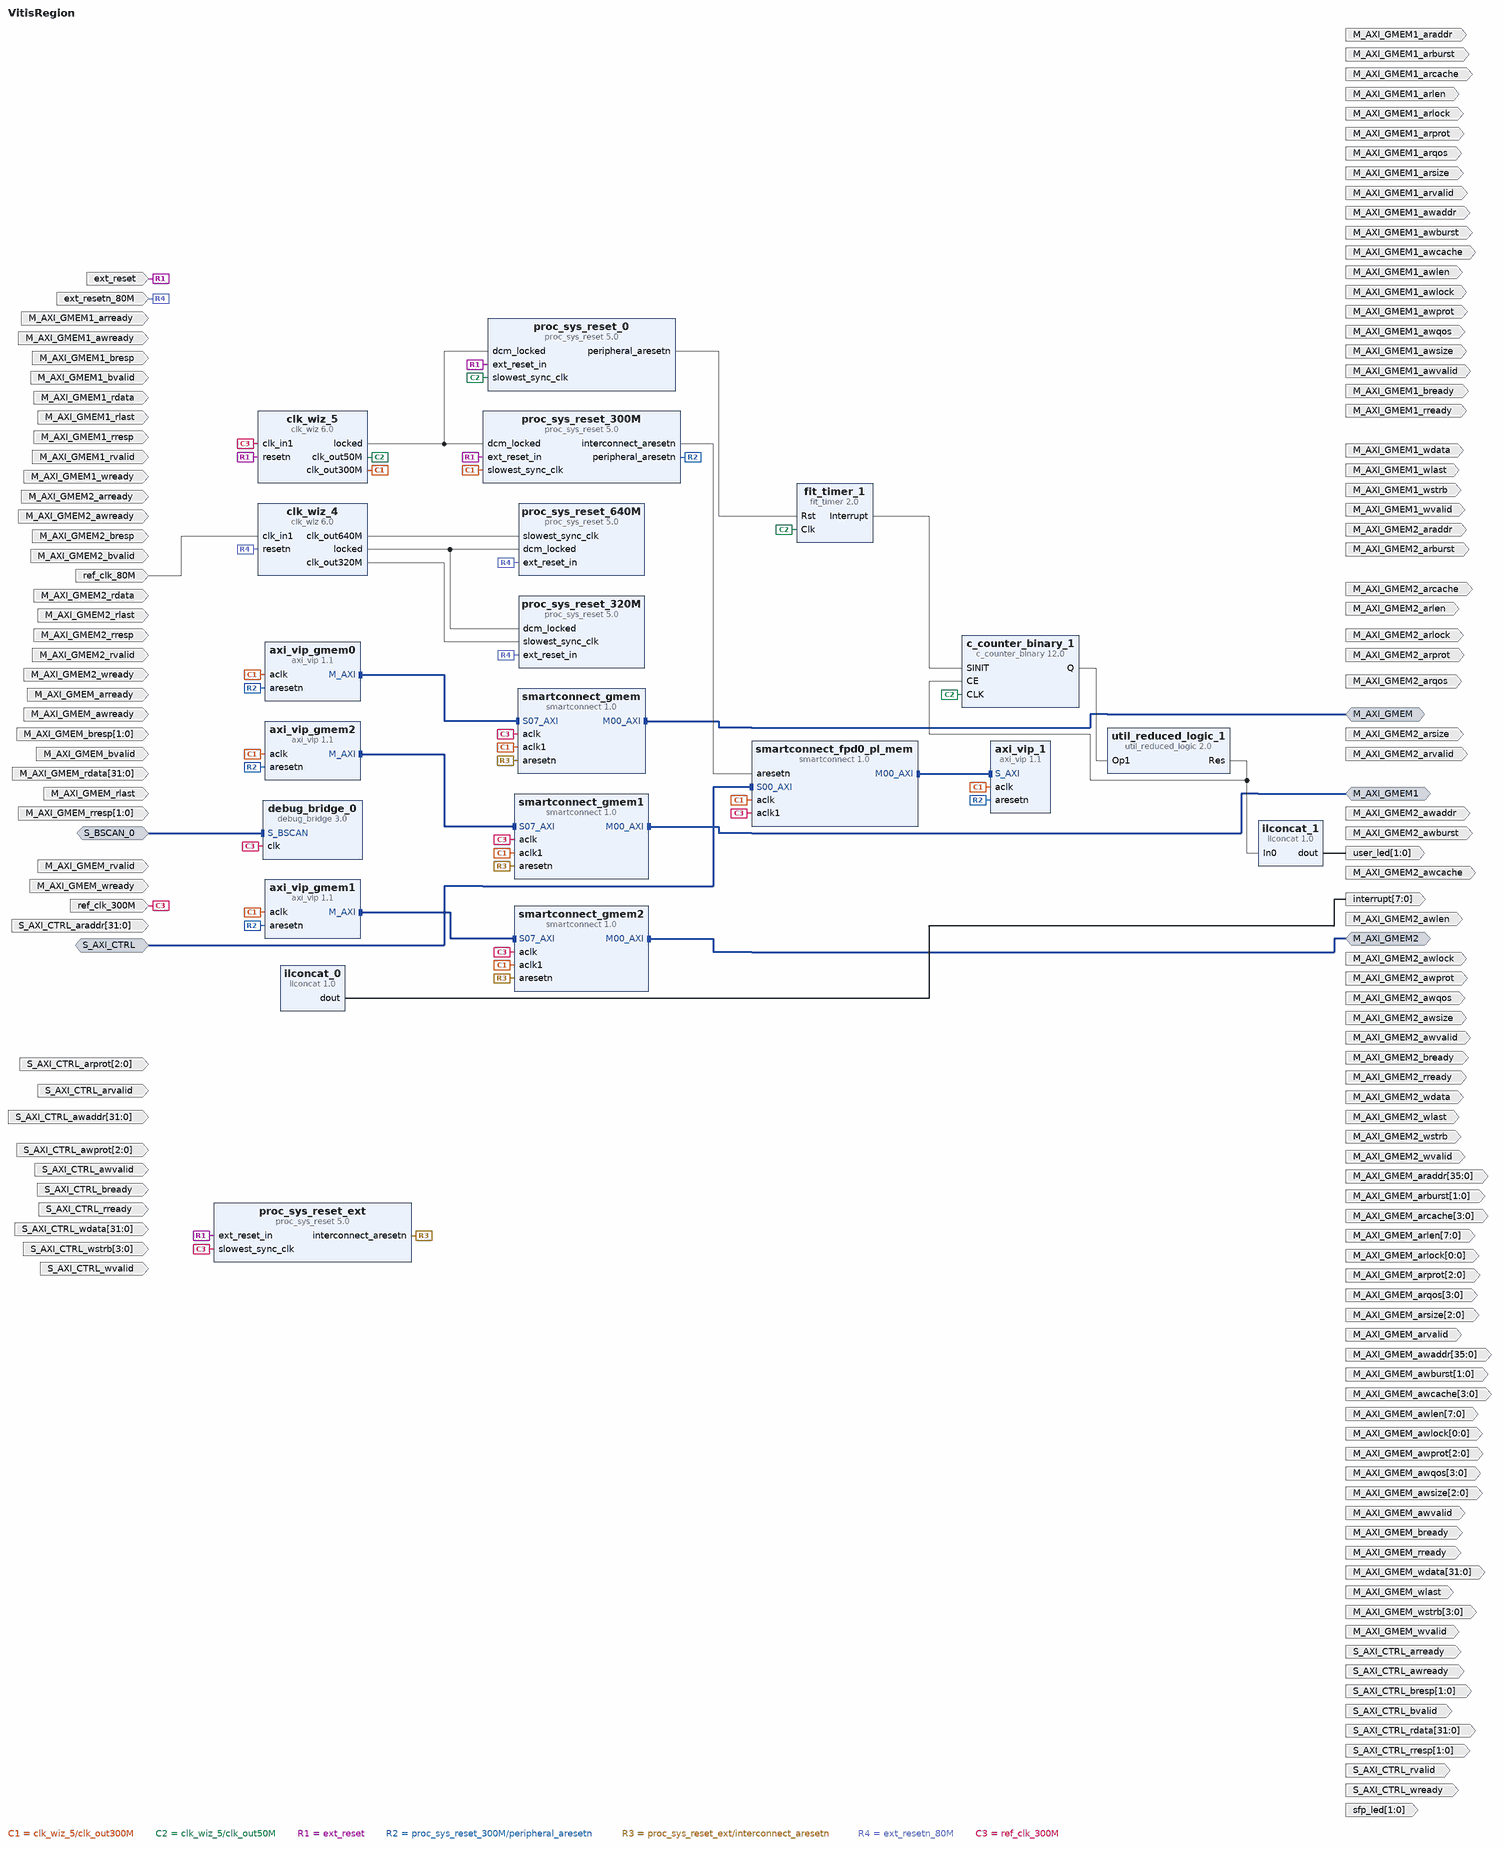
[diagram p0: block diagram of the top level]
# Vivado block design VitisRegion, xck26-sfvc784-2LV-c, Vivado 2025.2
create_bd_design VitisRegion

create_bd_intf_port -mode Master -vlnv xilinx.com:interface:aximm_rtl:1.0 M_AXI_GMEM
set_property -dict [list \
  CONFIG.ADDR_WIDTH 36 \
  CONFIG.DATA_WIDTH 32 \
  CONFIG.FREQ_HZ 300000000 \
  CONFIG.HAS_BURST 0 \
  CONFIG.HAS_LOCK 0 \
  CONFIG.HAS_QOS 0 \
  CONFIG.HAS_REGION 0 \
  CONFIG.HAS_RRESP 0 \
  CONFIG.NUM_READ_OUTSTANDING 2 \
  CONFIG.NUM_WRITE_OUTSTANDING 16 \
  CONFIG.PROTOCOL AXI4 \
  CONFIG.READ_WRITE_MODE READ_WRITE \
] [get_bd_intf_ports M_AXI_GMEM]
create_bd_intf_port -mode Slave -vlnv xilinx.com:interface:aximm_rtl:1.0 S_AXI_CTRL
set_property -dict [list \
  CONFIG.ADDR_WIDTH 32 \
  CONFIG.ARUSER_WIDTH 0 \
  CONFIG.AWUSER_WIDTH 0 \
  CONFIG.BUSER_WIDTH 0 \
  CONFIG.DATA_WIDTH 32 \
  CONFIG.FREQ_HZ 300000000 \
  CONFIG.HAS_BRESP 1 \
  CONFIG.HAS_BURST 0 \
  CONFIG.HAS_CACHE 0 \
  CONFIG.HAS_LOCK 0 \
  CONFIG.HAS_PROT 1 \
  CONFIG.HAS_QOS 0 \
  CONFIG.HAS_REGION 0 \
  CONFIG.HAS_RRESP 1 \
  CONFIG.HAS_WSTRB 1 \
  CONFIG.ID_WIDTH 0 \
  CONFIG.NUM_READ_OUTSTANDING 8 \
  CONFIG.NUM_READ_THREADS 1 \
  CONFIG.NUM_WRITE_OUTSTANDING 8 \
  CONFIG.NUM_WRITE_THREADS 1 \
  CONFIG.PROTOCOL AXI4LITE \
  CONFIG.READ_WRITE_MODE READ_WRITE \
  CONFIG.RUSER_BITS_PER_BYTE 0 \
  CONFIG.RUSER_WIDTH 0 \
  CONFIG.WUSER_BITS_PER_BYTE 0 \
  CONFIG.WUSER_WIDTH 0 \
] [get_bd_intf_ports S_AXI_CTRL]
create_bd_intf_port -mode Master -vlnv xilinx.com:interface:aximm_rtl:1.0 M_AXI_GMEM1
set_property -dict [list \
  CONFIG.ADDR_WIDTH 36 \
  CONFIG.DATA_WIDTH 32 \
  CONFIG.FREQ_HZ 300000000 \
  CONFIG.HAS_BURST 0 \
  CONFIG.HAS_LOCK 0 \
  CONFIG.HAS_QOS 0 \
  CONFIG.HAS_REGION 0 \
  CONFIG.HAS_RRESP 0 \
  CONFIG.NUM_READ_OUTSTANDING 2 \
  CONFIG.NUM_WRITE_OUTSTANDING 16 \
  CONFIG.PROTOCOL AXI4 \
  CONFIG.READ_WRITE_MODE READ_WRITE \
] [get_bd_intf_ports M_AXI_GMEM1]
create_bd_intf_port -mode Master -vlnv xilinx.com:interface:aximm_rtl:1.0 M_AXI_GMEM2
set_property -dict [list \
  CONFIG.ADDR_WIDTH 36 \
  CONFIG.DATA_WIDTH 32 \
  CONFIG.FREQ_HZ 300000000 \
  CONFIG.HAS_BURST 0 \
  CONFIG.HAS_LOCK 0 \
  CONFIG.HAS_QOS 0 \
  CONFIG.HAS_REGION 0 \
  CONFIG.HAS_RRESP 0 \
  CONFIG.NUM_READ_OUTSTANDING 2 \
  CONFIG.NUM_WRITE_OUTSTANDING 16 \
  CONFIG.PROTOCOL AXI4 \
  CONFIG.READ_WRITE_MODE READ_WRITE \
] [get_bd_intf_ports M_AXI_GMEM2]
create_bd_intf_port -mode Slave -vlnv xilinx.com:interface:bscan_rtl:1.0 S_BSCAN_0
create_bd_port -dir O -from 35 -to 0 M_AXI_GMEM_awaddr
create_bd_port -dir O -from 1 -to 0 M_AXI_GMEM_awburst
create_bd_port -dir O -from 3 -to 0 M_AXI_GMEM_awcache
create_bd_port -dir O -from 7 -to 0 M_AXI_GMEM_awlen
create_bd_port -dir O -from 2 -to 0 M_AXI_GMEM_awprot
create_bd_port -dir I M_AXI_GMEM_awready
create_bd_port -dir O -from 2 -to 0 M_AXI_GMEM_awsize
create_bd_port -dir O M_AXI_GMEM_awvalid
create_bd_port -dir O M_AXI_GMEM_bready
create_bd_port -dir I -from 1 -to 0 M_AXI_GMEM_bresp
create_bd_port -dir I M_AXI_GMEM_bvalid
create_bd_port -dir O -from 31 -to 0 M_AXI_GMEM_wdata
create_bd_port -dir O M_AXI_GMEM_wlast
create_bd_port -dir I M_AXI_GMEM_wready
create_bd_port -dir O -from 3 -to 0 M_AXI_GMEM_wstrb
create_bd_port -dir O M_AXI_GMEM_wvalid
create_bd_port -dir O -from 0 -to 0 M_AXI_GMEM_awlock
create_bd_port -dir O -from 3 -to 0 M_AXI_GMEM_awqos
create_bd_port -dir O -from 35 -to 0 M_AXI_GMEM_araddr
create_bd_port -dir O -from 1 -to 0 M_AXI_GMEM_arburst
create_bd_port -dir O -from 3 -to 0 M_AXI_GMEM_arcache
create_bd_port -dir O -from 7 -to 0 M_AXI_GMEM_arlen
create_bd_port -dir O -from 0 -to 0 M_AXI_GMEM_arlock
create_bd_port -dir O -from 2 -to 0 M_AXI_GMEM_arprot
create_bd_port -dir O -from 3 -to 0 M_AXI_GMEM_arqos
create_bd_port -dir I M_AXI_GMEM_arready
create_bd_port -dir O -from 2 -to 0 M_AXI_GMEM_arsize
create_bd_port -dir O M_AXI_GMEM_arvalid
create_bd_port -dir I -from 31 -to 0 M_AXI_GMEM_rdata
create_bd_port -dir I M_AXI_GMEM_rlast
create_bd_port -dir O M_AXI_GMEM_rready
create_bd_port -dir I -from 1 -to 0 M_AXI_GMEM_rresp
create_bd_port -dir I M_AXI_GMEM_rvalid
create_bd_port -dir I -from 31 -to 0 S_AXI_CTRL_awaddr
create_bd_port -dir I -from 2 -to 0 S_AXI_CTRL_awprot
create_bd_port -dir I S_AXI_CTRL_awvalid
create_bd_port -dir O S_AXI_CTRL_awready
create_bd_port -dir I -from 31 -to 0 S_AXI_CTRL_wdata
create_bd_port -dir I -from 3 -to 0 S_AXI_CTRL_wstrb
create_bd_port -dir I S_AXI_CTRL_wvalid
create_bd_port -dir O S_AXI_CTRL_wready
create_bd_port -dir O -from 1 -to 0 S_AXI_CTRL_bresp
create_bd_port -dir O S_AXI_CTRL_bvalid
create_bd_port -dir I S_AXI_CTRL_bready
create_bd_port -dir I -from 31 -to 0 S_AXI_CTRL_araddr
create_bd_port -dir I -from 2 -to 0 S_AXI_CTRL_arprot
create_bd_port -dir I S_AXI_CTRL_arvalid
create_bd_port -dir O S_AXI_CTRL_arready
create_bd_port -dir O -from 31 -to 0 S_AXI_CTRL_rdata
create_bd_port -dir O -from 1 -to 0 S_AXI_CTRL_rresp
create_bd_port -dir O S_AXI_CTRL_rvalid
create_bd_port -dir I S_AXI_CTRL_rready
create_bd_port -dir O M_AXI_GMEM1_awaddr
create_bd_port -dir O M_AXI_GMEM1_awburst
create_bd_port -dir O M_AXI_GMEM1_awcache
create_bd_port -dir O M_AXI_GMEM1_awlen
create_bd_port -dir O M_AXI_GMEM1_awprot
create_bd_port -dir I M_AXI_GMEM1_awready
create_bd_port -dir O M_AXI_GMEM1_awsize
create_bd_port -dir O M_AXI_GMEM1_awvalid
create_bd_port -dir O M_AXI_GMEM1_bready
create_bd_port -dir I M_AXI_GMEM1_bresp
create_bd_port -dir I M_AXI_GMEM1_bvalid
create_bd_port -dir O M_AXI_GMEM1_wdata
create_bd_port -dir O M_AXI_GMEM1_wlast
create_bd_port -dir I M_AXI_GMEM1_wready
create_bd_port -dir O M_AXI_GMEM1_wstrb
create_bd_port -dir O M_AXI_GMEM1_wvalid
create_bd_port -dir O M_AXI_GMEM1_awlock
create_bd_port -dir O M_AXI_GMEM1_awqos
create_bd_port -dir O M_AXI_GMEM1_araddr
create_bd_port -dir O M_AXI_GMEM1_arburst
create_bd_port -dir O M_AXI_GMEM1_arcache
create_bd_port -dir O M_AXI_GMEM1_arlen
create_bd_port -dir O M_AXI_GMEM1_arlock
create_bd_port -dir O M_AXI_GMEM1_arprot
create_bd_port -dir O M_AXI_GMEM1_arqos
create_bd_port -dir I M_AXI_GMEM1_arready
create_bd_port -dir O M_AXI_GMEM1_arsize
create_bd_port -dir O M_AXI_GMEM1_arvalid
create_bd_port -dir I M_AXI_GMEM1_rdata
create_bd_port -dir I M_AXI_GMEM1_rlast
create_bd_port -dir O M_AXI_GMEM1_rready
create_bd_port -dir I M_AXI_GMEM1_rresp
create_bd_port -dir I M_AXI_GMEM1_rvalid
create_bd_port -dir O M_AXI_GMEM2_awaddr
create_bd_port -dir O M_AXI_GMEM2_awburst
create_bd_port -dir O M_AXI_GMEM2_awcache
create_bd_port -dir O M_AXI_GMEM2_awlen
create_bd_port -dir O M_AXI_GMEM2_awprot
create_bd_port -dir I M_AXI_GMEM2_awready
create_bd_port -dir O M_AXI_GMEM2_awsize
create_bd_port -dir O M_AXI_GMEM2_awvalid
create_bd_port -dir O M_AXI_GMEM2_bready
create_bd_port -dir I M_AXI_GMEM2_bresp
create_bd_port -dir I M_AXI_GMEM2_bvalid
create_bd_port -dir O M_AXI_GMEM2_wdata
create_bd_port -dir O M_AXI_GMEM2_wlast
create_bd_port -dir I M_AXI_GMEM2_wready
create_bd_port -dir O M_AXI_GMEM2_wstrb
create_bd_port -dir O M_AXI_GMEM2_wvalid
create_bd_port -dir O M_AXI_GMEM2_awlock
create_bd_port -dir O M_AXI_GMEM2_awqos
create_bd_port -dir O M_AXI_GMEM2_araddr
create_bd_port -dir O M_AXI_GMEM2_arburst
create_bd_port -dir O M_AXI_GMEM2_arcache
create_bd_port -dir O M_AXI_GMEM2_arlen
create_bd_port -dir O M_AXI_GMEM2_arlock
create_bd_port -dir O M_AXI_GMEM2_arprot
create_bd_port -dir O M_AXI_GMEM2_arqos
create_bd_port -dir I M_AXI_GMEM2_arready
create_bd_port -dir O M_AXI_GMEM2_arsize
create_bd_port -dir O M_AXI_GMEM2_arvalid
create_bd_port -dir I M_AXI_GMEM2_rdata
create_bd_port -dir I M_AXI_GMEM2_rlast
create_bd_port -dir O M_AXI_GMEM2_rready
create_bd_port -dir I M_AXI_GMEM2_rresp
create_bd_port -dir I M_AXI_GMEM2_rvalid
create_bd_port -dir I -type rst ext_reset
create_bd_port -dir I -type clk ref_clk_300M
set_property -dict [list \
  CONFIG.ASSOCIATED_BUSIF M_AXI_GMEM:S_AXI_CTRL:M_AXI_GMEM1:M_AXI_GMEM2 \
  CONFIG.ASSOCIATED_RESET ext_reset \
  CONFIG.FREQ_HZ 300000000 \
] [get_bd_ports ref_clk_300M]
create_bd_port -dir O -from 1 -to 0 -type data sfp_led
create_bd_port -dir O -from 1 -to 0 -type data user_led
create_bd_port -dir I -type clk ref_clk_80M
set_property -dict {CONFIG.ASSOCIATED_RESET ext_resetn_80M CONFIG.FREQ_HZ 80000000} [get_bd_ports ref_clk_80M]
create_bd_port -dir I -type rst ext_resetn_80M
create_bd_port -dir O -from 7 -to 0 interrupt

create_bd_cell -type ip -vlnv xilinx.com:ip:proc_sys_reset:5.0 proc_sys_reset_ext
create_bd_cell -type ip -vlnv xilinx.com:ip:smartconnect:1.0 smartconnect_fpd0_pl_mem
set_property -dict {CONFIG.NUM_CLKS 2 CONFIG.NUM_MI 1 CONFIG.NUM_SI 1} [get_bd_cells smartconnect_fpd0_pl_mem]
create_bd_cell -type ip -vlnv xilinx.com:ip:proc_sys_reset:5.0 proc_sys_reset_300M
create_bd_cell -type ip -vlnv xilinx.com:ip:clk_wiz:6.0 clk_wiz_4
set_property -dict [list \
  CONFIG.CLKIN1_JITTER_PS 125.0 \
  CONFIG.CLKOUT1_DRIVES Buffer \
  CONFIG.CLKOUT1_JITTER 82.169 \
  CONFIG.CLKOUT1_MATCHED_ROUTING false \
  CONFIG.CLKOUT1_PHASE_ERROR 94.353 \
  CONFIG.CLKOUT1_REQUESTED_OUT_FREQ 640 \
  CONFIG.CLKOUT1_USED true \
  CONFIG.CLKOUT2_DRIVES Buffer \
  CONFIG.CLKOUT2_JITTER 92.433 \
  CONFIG.CLKOUT2_MATCHED_ROUTING true \
  CONFIG.CLKOUT2_PHASE_ERROR 94.353 \
  CONFIG.CLKOUT2_REQUESTED_OUT_FREQ 320 \
  CONFIG.CLKOUT2_USED true \
  CONFIG.CLKOUT3_DRIVES Buffer \
  CONFIG.CLKOUT4_DRIVES Buffer \
  CONFIG.CLKOUT5_DRIVES Buffer \
  CONFIG.CLKOUT6_DRIVES Buffer \
  CONFIG.CLKOUT7_DRIVES Buffer \
  CONFIG.CLK_OUT1_PORT clk_out640M \
  CONFIG.CLK_OUT2_PORT clk_out320M \
  CONFIG.FEEDBACK_SOURCE FDBK_ONCHIP \
  CONFIG.MMCM_BANDWIDTH OPTIMIZED \
  CONFIG.MMCM_CLKFBOUT_MULT_F 16 \
  CONFIG.MMCM_CLKIN1_PERIOD 12.500 \
  CONFIG.MMCM_CLKIN2_PERIOD 10.0 \
  CONFIG.MMCM_CLKOUT0_DIVIDE_F 2 \
  CONFIG.MMCM_CLKOUT1_DIVIDE 4 \
  CONFIG.MMCM_COMPENSATION AUTO \
  CONFIG.MMCM_DIVCLK_DIVIDE 1 \
  CONFIG.NUM_OUT_CLKS 2 \
  CONFIG.OPTIMIZE_CLOCKING_STRUCTURE_EN true \
  CONFIG.PLL_CLKIN_PERIOD 12.500 \
  CONFIG.PRIMITIVE PLL \
  CONFIG.PRIM_IN_FREQ 80.000 \
  CONFIG.PRIM_SOURCE Global_buffer \
  CONFIG.RESET_PORT resetn \
  CONFIG.RESET_TYPE ACTIVE_LOW \
] [get_bd_cells clk_wiz_4]
create_bd_cell -type ip -vlnv xilinx.com:ip:clk_wiz:6.0 clk_wiz_5
set_property -dict [list \
  CONFIG.CLKIN1_JITTER_PS 33.330000000000005 \
  CONFIG.CLKOUT1_DRIVES Buffer \
  CONFIG.CLKOUT1_JITTER 116.415 \
  CONFIG.CLKOUT1_MATCHED_ROUTING false \
  CONFIG.CLKOUT1_PHASE_ERROR 77.836 \
  CONFIG.CLKOUT1_REQUESTED_OUT_FREQ 50.000 \
  CONFIG.CLKOUT1_USED true \
  CONFIG.CLKOUT2_DRIVES Buffer \
  CONFIG.CLKOUT2_JITTER 81.814 \
  CONFIG.CLKOUT2_MATCHED_ROUTING false \
  CONFIG.CLKOUT2_PHASE_ERROR 77.836 \
  CONFIG.CLKOUT2_REQUESTED_OUT_FREQ 300.000 \
  CONFIG.CLKOUT2_USED true \
  CONFIG.CLKOUT3_DRIVES Buffer \
  CONFIG.CLKOUT4_DRIVES Buffer \
  CONFIG.CLKOUT5_DRIVES Buffer \
  CONFIG.CLKOUT6_DRIVES Buffer \
  CONFIG.CLKOUT7_DRIVES Buffer \
  CONFIG.CLK_OUT1_PORT clk_out50M \
  CONFIG.CLK_OUT2_PORT clk_out300M \
  CONFIG.FEEDBACK_SOURCE FDBK_ONCHIP \
  CONFIG.MMCM_BANDWIDTH OPTIMIZED \
  CONFIG.MMCM_CLKFBOUT_MULT_F 4.000 \
  CONFIG.MMCM_CLKIN1_PERIOD 3.333 \
  CONFIG.MMCM_CLKIN2_PERIOD 10.0 \
  CONFIG.MMCM_CLKOUT0_DIVIDE_F 24.000 \
  CONFIG.MMCM_CLKOUT1_DIVIDE 4 \
  CONFIG.MMCM_COMPENSATION AUTO \
  CONFIG.MMCM_DIVCLK_DIVIDE 1 \
  CONFIG.NUM_OUT_CLKS 2 \
  CONFIG.OPTIMIZE_CLOCKING_STRUCTURE_EN true \
  CONFIG.PLL_CLKIN_PERIOD 3.333 \
  CONFIG.PRIMITIVE MMCM \
  CONFIG.PRIM_IN_FREQ 300.000 \
  CONFIG.PRIM_SOURCE Global_buffer \
  CONFIG.RESET_PORT resetn \
  CONFIG.RESET_TYPE ACTIVE_LOW \
] [get_bd_cells clk_wiz_5]
create_bd_cell -type ip -vlnv xilinx.com:ip:proc_sys_reset:5.0 proc_sys_reset_640M
create_bd_cell -type ip -vlnv xilinx.com:ip:proc_sys_reset:5.0 proc_sys_reset_320M
create_bd_cell -type ip -vlnv xilinx.com:ip:smartconnect:1.0 smartconnect_gmem
set_property -dict {CONFIG.NUM_CLKS 2 CONFIG.NUM_SI 8} [get_bd_cells smartconnect_gmem]
create_bd_cell -type inline_hdl -vlnv xilinx.com:inline_hdl:ilconcat:1.0 ilconcat_0
set_property -dict {CONFIG.NUM_PORTS 8} [get_bd_cells ilconcat_0]
create_bd_cell -type ip -vlnv xilinx.com:ip:c_counter_binary:12.0 c_counter_binary_1
set_property -dict [list \
  CONFIG.CE true \
  CONFIG.Count_Mode DOWN \
  CONFIG.Fb_Latency_Configuration Automatic \
  CONFIG.Increment_Value 1 \
  CONFIG.Latency_Configuration Automatic \
  CONFIG.Load false \
  CONFIG.Output_Width 23 \
  CONFIG.Restrict_Count false \
  CONFIG.SCLR false \
  CONFIG.SINIT true \
  CONFIG.SINIT_Value 4c4b40 \
  CONFIG.SSET false \
  CONFIG.Sync_Threshold_Output false \
] [get_bd_cells c_counter_binary_1]
create_bd_cell -type ip -vlnv xilinx.com:ip:fit_timer:2.0 fit_timer_1
set_property -dict {CONFIG.C_INACCURACY 200 CONFIG.C_NO_CLOCKS 50000000} [get_bd_cells fit_timer_1]
create_bd_cell -type ip -vlnv xilinx.com:ip:util_reduced_logic:2.0 util_reduced_logic_1
set_property -dict {CONFIG.C_OPERATION or CONFIG.C_SIZE 23} [get_bd_cells util_reduced_logic_1]
create_bd_cell -type inline_hdl -vlnv xilinx.com:inline_hdl:ilconcat:1.0 ilconcat_1
create_bd_cell -type ip -vlnv xilinx.com:ip:proc_sys_reset:5.0 proc_sys_reset_0
create_bd_cell -type ip -vlnv xilinx.com:ip:debug_bridge:3.0 debug_bridge_0
set_property -dict {CONFIG.C_DEBUG_MODE 1 CONFIG.C_DESIGN_TYPE 1 CONFIG.C_NUM_BS_MASTER 0} [get_bd_cells debug_bridge_0]
create_bd_cell -type ip -vlnv xilinx.com:ip:axi_vip:1.1 axi_vip_1
set_property -dict [list \
  CONFIG.ADDR_WIDTH 32 \
  CONFIG.DATA_WIDTH 32 \
  CONFIG.INTERFACE_MODE SLAVE \
  CONFIG.PROTOCOL AXI4LITE \
  CONFIG.READ_WRITE_MODE READ_WRITE \
] [get_bd_cells axi_vip_1]
create_bd_cell -type ip -vlnv xilinx.com:ip:smartconnect:1.0 smartconnect_gmem1
set_property -dict {CONFIG.NUM_CLKS 2 CONFIG.NUM_SI 8} [get_bd_cells smartconnect_gmem1]
create_bd_cell -type ip -vlnv xilinx.com:ip:smartconnect:1.0 smartconnect_gmem2
set_property -dict {CONFIG.NUM_CLKS 2 CONFIG.NUM_SI 8} [get_bd_cells smartconnect_gmem2]
create_bd_cell -type ip -vlnv xilinx.com:ip:axi_vip:1.1 axi_vip_gmem0
set_property -dict [list \
  CONFIG.ADDR_WIDTH 32 \
  CONFIG.ARUSER_WIDTH 0 \
  CONFIG.AWUSER_WIDTH 0 \
  CONFIG.BUSER_WIDTH 0 \
  CONFIG.DATA_WIDTH 32 \
  CONFIG.HAS_BRESP 1 \
  CONFIG.HAS_BURST 1 \
  CONFIG.HAS_CACHE 1 \
  CONFIG.HAS_LOCK 1 \
  CONFIG.HAS_PROT 1 \
  CONFIG.HAS_QOS 1 \
  CONFIG.HAS_REGION 1 \
  CONFIG.HAS_RRESP 1 \
  CONFIG.HAS_WSTRB 1 \
  CONFIG.ID_WIDTH 0 \
  CONFIG.INTERFACE_MODE MASTER \
  CONFIG.PROTOCOL AXI4 \
  CONFIG.READ_WRITE_MODE READ_WRITE \
  CONFIG.RUSER_WIDTH 0 \
  CONFIG.SUPPORTS_NARROW 1 \
  CONFIG.WUSER_WIDTH 0 \
] [get_bd_cells axi_vip_gmem0]
create_bd_cell -type ip -vlnv xilinx.com:ip:axi_vip:1.1 axi_vip_gmem1
set_property -dict [list \
  CONFIG.ADDR_WIDTH 32 \
  CONFIG.ARUSER_WIDTH 0 \
  CONFIG.AWUSER_WIDTH 0 \
  CONFIG.BUSER_WIDTH 0 \
  CONFIG.DATA_WIDTH 32 \
  CONFIG.HAS_BRESP 1 \
  CONFIG.HAS_BURST 1 \
  CONFIG.HAS_CACHE 1 \
  CONFIG.HAS_LOCK 1 \
  CONFIG.HAS_PROT 1 \
  CONFIG.HAS_QOS 1 \
  CONFIG.HAS_REGION 1 \
  CONFIG.HAS_RRESP 1 \
  CONFIG.HAS_WSTRB 1 \
  CONFIG.ID_WIDTH 0 \
  CONFIG.INTERFACE_MODE MASTER \
  CONFIG.PROTOCOL AXI4 \
  CONFIG.READ_WRITE_MODE READ_WRITE \
  CONFIG.RUSER_WIDTH 0 \
  CONFIG.SUPPORTS_NARROW 1 \
  CONFIG.WUSER_WIDTH 0 \
] [get_bd_cells axi_vip_gmem1]
create_bd_cell -type ip -vlnv xilinx.com:ip:axi_vip:1.1 axi_vip_gmem2
set_property -dict [list \
  CONFIG.ADDR_WIDTH 32 \
  CONFIG.ARUSER_WIDTH 0 \
  CONFIG.AWUSER_WIDTH 0 \
  CONFIG.BUSER_WIDTH 0 \
  CONFIG.DATA_WIDTH 32 \
  CONFIG.HAS_BRESP 1 \
  CONFIG.HAS_BURST 1 \
  CONFIG.HAS_CACHE 1 \
  CONFIG.HAS_LOCK 1 \
  CONFIG.HAS_PROT 1 \
  CONFIG.HAS_QOS 1 \
  CONFIG.HAS_REGION 1 \
  CONFIG.HAS_RRESP 1 \
  CONFIG.HAS_WSTRB 1 \
  CONFIG.ID_WIDTH 0 \
  CONFIG.INTERFACE_MODE MASTER \
  CONFIG.PROTOCOL AXI4 \
  CONFIG.READ_WRITE_MODE READ_WRITE \
  CONFIG.RUSER_WIDTH 0 \
  CONFIG.SUPPORTS_NARROW 1 \
  CONFIG.WUSER_WIDTH 0 \
] [get_bd_cells axi_vip_gmem2]

# ---- connections ----

connect_bd_intf_net [get_bd_intf_ports S_AXI_CTRL] [get_bd_intf_pins smartconnect_fpd0_pl_mem/S00_AXI]
connect_bd_intf_net -intf_net S_BSCAN_0_1 [get_bd_intf_ports S_BSCAN_0] [get_bd_intf_pins debug_bridge_0/S_BSCAN]
connect_bd_intf_net [get_bd_intf_pins axi_vip_gmem0/M_AXI] [get_bd_intf_pins smartconnect_gmem/S07_AXI]
connect_bd_intf_net [get_bd_intf_pins axi_vip_gmem1/M_AXI] [get_bd_intf_pins smartconnect_gmem2/S07_AXI]
connect_bd_intf_net [get_bd_intf_pins axi_vip_gmem2/M_AXI] [get_bd_intf_pins smartconnect_gmem1/S07_AXI]
connect_bd_intf_net -intf_net smartconnect_0_M00_AXI [get_bd_intf_ports M_AXI_GMEM] [get_bd_intf_pins smartconnect_gmem/M00_AXI]
connect_bd_intf_net [get_bd_intf_pins axi_vip_1/S_AXI] [get_bd_intf_pins smartconnect_fpd0_pl_mem/M00_AXI]
connect_bd_intf_net [get_bd_intf_ports M_AXI_GMEM1] [get_bd_intf_pins smartconnect_gmem1/M00_AXI]
connect_bd_intf_net [get_bd_intf_ports M_AXI_GMEM2] [get_bd_intf_pins smartconnect_gmem2/M00_AXI]
connect_bd_net [get_bd_pins c_counter_binary_1/Q] [get_bd_pins util_reduced_logic_1/Op1]
connect_bd_net -net clk_in1_0_1 [get_bd_ports ref_clk_80M] [get_bd_pins clk_wiz_4/clk_in1]
connect_bd_net -net clk_wiz_0_clk_out300M [get_bd_pins clk_wiz_5/clk_out300M] \
  [get_bd_pins smartconnect_fpd0_pl_mem/aclk] [get_bd_pins proc_sys_reset_300M/slowest_sync_clk] \
  [get_bd_pins smartconnect_gmem/aclk1] [get_bd_pins axi_vip_1/aclk] [get_bd_pins smartconnect_gmem2/aclk1] \
  [get_bd_pins smartconnect_gmem1/aclk1] [get_bd_pins axi_vip_gmem1/aclk] [get_bd_pins axi_vip_gmem2/aclk] \
  [get_bd_pins axi_vip_gmem0/aclk]
connect_bd_net [get_bd_pins clk_wiz_4/clk_out320M] [get_bd_pins proc_sys_reset_320M/slowest_sync_clk]
connect_bd_net [get_bd_pins clk_wiz_4/clk_out640M] [get_bd_pins proc_sys_reset_640M/slowest_sync_clk]
connect_bd_net [get_bd_pins clk_wiz_4/locked] [get_bd_pins proc_sys_reset_640M/dcm_locked] [get_bd_pins proc_sys_reset_320M/dcm_locked]
connect_bd_net -net clk_wiz_5_clk_out600M [get_bd_pins clk_wiz_5/clk_out50M] \
  [get_bd_pins c_counter_binary_1/CLK] [get_bd_pins fit_timer_1/Clk] [get_bd_pins proc_sys_reset_0/slowest_sync_clk]
connect_bd_net [get_bd_pins clk_wiz_5/locked] [get_bd_pins proc_sys_reset_300M/dcm_locked] [get_bd_pins proc_sys_reset_0/dcm_locked]
connect_bd_net -net ext_reset_in_0_1 [get_bd_ports ext_reset] \
  [get_bd_pins proc_sys_reset_ext/ext_reset_in] [get_bd_pins proc_sys_reset_300M/ext_reset_in] [get_bd_pins clk_wiz_5/resetn] \
  [get_bd_pins proc_sys_reset_0/ext_reset_in]
connect_bd_net [get_bd_pins fit_timer_1/Interrupt] [get_bd_pins c_counter_binary_1/SINIT]
connect_bd_net [get_bd_pins ilconcat_0/dout] [get_bd_ports interrupt]
connect_bd_net [get_bd_pins ilconcat_1/dout] [get_bd_ports user_led]
connect_bd_net [get_bd_pins proc_sys_reset_0/peripheral_aresetn] [get_bd_pins fit_timer_1/Rst]
connect_bd_net -net proc_sys_reset_1_interconnect_aresetn [get_bd_pins proc_sys_reset_300M/interconnect_aresetn] \
  [get_bd_pins smartconnect_fpd0_pl_mem/aresetn]
connect_bd_net [get_bd_pins proc_sys_reset_300M/peripheral_aresetn] \
  [get_bd_pins axi_vip_1/aresetn] [get_bd_pins axi_vip_gmem1/aresetn] [get_bd_pins axi_vip_gmem2/aresetn] \
  [get_bd_pins axi_vip_gmem0/aresetn]
connect_bd_net [get_bd_pins proc_sys_reset_ext/interconnect_aresetn] \
  [get_bd_pins smartconnect_gmem/aresetn] [get_bd_pins smartconnect_gmem2/aresetn] [get_bd_pins smartconnect_gmem1/aresetn]
connect_bd_net -net resetn_0_1 [get_bd_ports ext_resetn_80M] \
  [get_bd_pins clk_wiz_4/resetn] [get_bd_pins proc_sys_reset_640M/ext_reset_in] \
  [get_bd_pins proc_sys_reset_320M/ext_reset_in]
connect_bd_net -net slowest_sync_clk_0_1 [get_bd_ports ref_clk_300M] \
  [get_bd_pins proc_sys_reset_ext/slowest_sync_clk] [get_bd_pins smartconnect_fpd0_pl_mem/aclk1] \
  [get_bd_pins clk_wiz_5/clk_in1] [get_bd_pins smartconnect_gmem/aclk] [get_bd_pins debug_bridge_0/clk] \
  [get_bd_pins smartconnect_gmem2/aclk] [get_bd_pins smartconnect_gmem1/aclk]
connect_bd_net [get_bd_pins util_reduced_logic_1/Res] [get_bd_pins ilconcat_1/In0] [get_bd_pins c_counter_binary_1/CE]
set_property PFM.AXI_PORT {M01_AXI {memport "M_AXI_GP" sptag "" memory "" is_range "true"} M02_AXI {memport "M_AXI_GP" sptag "" memory "" is_range "true"} M03_AXI {memport "M_AXI_GP" sptag "" memory "" is_range "true"} M04_AXI {memport "M_AXI_GP" sptag "" memory "" is_range "true"} M05_AXI {memport "M_AXI_GP" sptag "" memory "" is_range "true"} M06_AXI {memport "M_AXI_GP" sptag "" memory "" is_range "true"} M07_AXI {memport "M_AXI_GP" sptag "" memory "" is_range "true"} M08_AXI {memport "M_AXI_GP" sptag "" memory "" is_range "true"} M09_AXI {memport "M_AXI_GP" sptag "" memory "" is_range "true"} M10_AXI {memport "M_AXI_GP" sptag "" memory "" is_range "true"} M11_AXI {memport "M_AXI_GP" sptag "" memory "" is_range "true"} M12_AXI {memport "M_AXI_GP" sptag "" memory "" is_range "true"} M13_AXI {memport "M_AXI_GP" sptag "" memory "" is_range "true"} M14_AXI {memport "M_AXI_GP" sptag "" memory "" is_range "true"}} [get_bd_cells smartconnect_fpd0_pl_mem]
set_property PFM.CLOCK {clk_out640M {id "3" is_default "false" proc_sys_reset "/proc_sys_reset_640M" status "fixed" freq_hz "640000000"} clk_out320M {id "2" is_default "false" proc_sys_reset "/proc_sys_reset_320M" status "fixed" freq_hz "320000000"}} [get_bd_cells clk_wiz_4]
set_property PFM.CLOCK {clk_out300M {id "1" is_default "true" proc_sys_reset "/proc_sys_reset_300M" status "fixed" freq_hz "300000000"}} [get_bd_cells clk_wiz_5]
set_property PFM.AXI_PORT {S00_AXI {memport "S_AXI_HP" sptag "HP0" memory "M_AXI_GMEM Reg" is_range "true"} S01_AXI {memport "S_AXI_HP" sptag "HP0" memory "M_AXI_GMEM Reg" is_range "true"} S02_AXI {memport "S_AXI_HP" sptag "HP0" memory "M_AXI_GMEM Reg" is_range "true"} S03_AXI {memport "S_AXI_HP" sptag "HP0" memory "M_AXI_GMEM Reg" is_range "true"} S04_AXI {memport "S_AXI_HP" sptag "HP0" memory "M_AXI_GMEM Reg" is_range "true"} S05_AXI {memport "S_AXI_HP" sptag "HP0" memory "M_AXI_GMEM Reg" is_range "true"} S06_AXI {memport "S_AXI_HP" sptag "HP0" memory "M_AXI_GMEM Reg" is_range "true"}} [get_bd_cells smartconnect_gmem]
set_property PFM.IRQ {In0 {id 0 is_range "false"} In1 {id 1 is_range "false"} In2 {id 2 is_range "false"} In3 {id 3 is_range "false"} In4 {id 4 is_range "false"} In5 {id 5 is_range "false"} In6 {id 6 is_range "false"} In7 {id 7 is_range "false"}} [get_bd_cells ilconcat_0]
set_property PFM.AXI_PORT {S00_AXI {memport "S_AXI_HP" sptag "HPC0" memory "M_AXI_GMEM1 Reg" is_range "true"} S01_AXI {memport "S_AXI_HP" sptag "HPC0" memory "M_AXI_GMEM1 Reg" is_range "true"} S02_AXI {memport "S_AXI_HP" sptag "HPC0" memory "M_AXI_GMEM1 Reg" is_range "true"} S03_AXI {memport "S_AXI_HP" sptag "HPC0" memory "M_AXI_GMEM1 Reg" is_range "true"} S04_AXI {memport "S_AXI_HP" sptag "HPC0" memory "M_AXI_GMEM1 Reg" is_range "true"} S05_AXI {memport "S_AXI_HP" sptag "HPC0" memory "M_AXI_GMEM1 Reg" is_range "true"} S06_AXI {memport "S_AXI_HP" sptag "HPC0" memory "M_AXI_GMEM1 Reg" is_range "true"}} [get_bd_cells smartconnect_gmem1]
set_property PFM.AXI_PORT {S00_AXI {memport "S_AXI_HP" sptag "HPC1" memory "M_AXI_GMEM2 Reg" is_range "true"} S01_AXI {memport "S_AXI_HP" sptag "HPC1" memory "M_AXI_GMEM2 Reg" is_range "true"} S02_AXI {memport "S_AXI_HP" sptag "HPC1" memory "M_AXI_GMEM2 Reg" is_range "true"} S03_AXI {memport "S_AXI_HP" sptag "HPC1" memory "M_AXI_GMEM2 Reg" is_range "true"} S04_AXI {memport "S_AXI_HP" sptag "HPC1" memory "M_AXI_GMEM2 Reg" is_range "true"} S05_AXI {memport "S_AXI_HP" sptag "HPC1" memory "M_AXI_GMEM2 Reg" is_range "true"} S06_AXI {memport "S_AXI_HP" sptag "HPC1" memory "M_AXI_GMEM2 Reg" is_range "true"}} [get_bd_cells smartconnect_gmem2]

# ---- address map ----
assign_bd_address -offset 0x3FFF0000 -range 4K -target_address_space [get_bd_addr_spaces axi_vip_gmem0/Master_AXI] [get_bd_addr_segs M_AXI_GMEM/Reg]
assign_bd_address -offset 0x3FFE0000 -range 4K -target_address_space [get_bd_addr_spaces axi_vip_gmem1/Master_AXI] [get_bd_addr_segs M_AXI_GMEM2/Reg]
assign_bd_address -offset 0x3FFD0000 -range 4K -target_address_space [get_bd_addr_spaces axi_vip_gmem2/Master_AXI] [get_bd_addr_segs M_AXI_GMEM1/Reg]
assign_bd_address -offset 0xB7FF0000 -range 64K -target_address_space [get_bd_addr_spaces S_AXI_CTRL] [get_bd_addr_segs axi_vip_1/S_AXI/Reg]

validate_bd_design
save_bd_design
